# Altium schematic sheet God68_Schematic_Altium.schdoc
size 476 x 264 mm
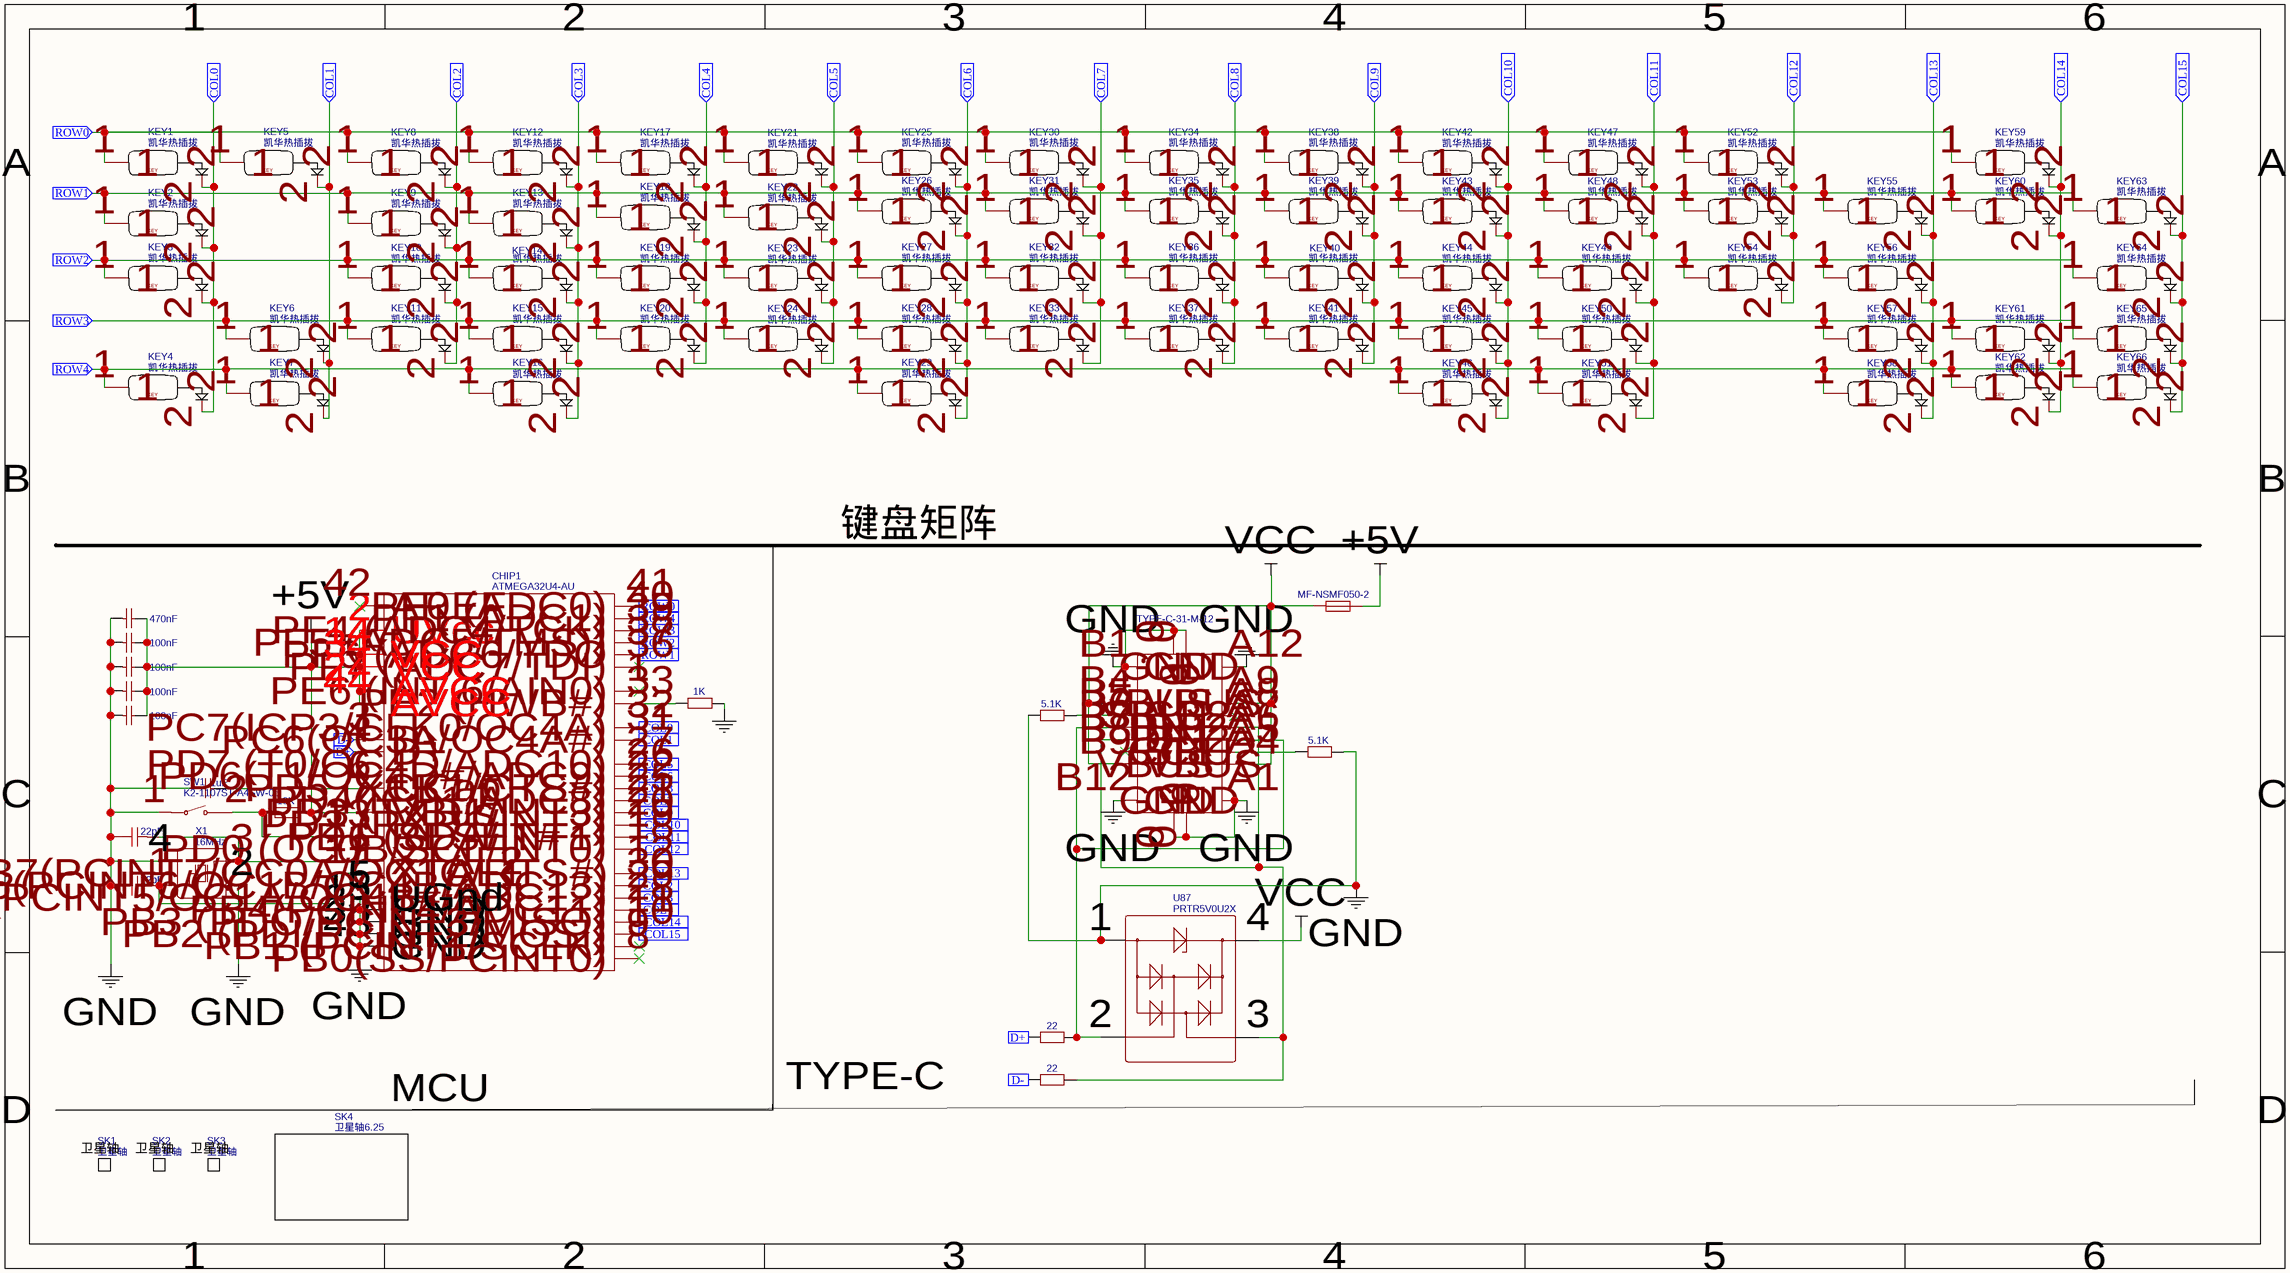
[diagram p0: God68_Schematic_Altium.schdoc]

## Parts
C4  100nF  [C0603]
C5  100nF  [C0603]
C6  100nF  [C0603]
C7  470nF  [C0603]
C10  100nF  [C0603]
C11  1uF  [C0603]
C12  22pF  [C0603]
C13  22pF  [C0603]
CHIP1  ATMEGA32U4-AU  [QFP-44_L10.0-W10.0-P0.80-LS13.2-BL]
KEY1  凯华热插拔  [凯华热插拔]
KEY2  凯华热插拔  [凯华热插拔]
KEY3  凯华热插拔  [凯华热插拔]
KEY4  凯华热插拔  [凯华热插拔]
KEY5  凯华热插拔  [凯华热插拔]
KEY6  凯华热插拔  [凯华热插拔]
KEY7  凯华热插拔  [凯华热插拔]
KEY8  凯华热插拔  [凯华热插拔]
KEY9  凯华热插拔  [凯华热插拔]
KEY10  凯华热插拔  [凯华热插拔]
KEY11  凯华热插拔  [凯华热插拔]
KEY12  凯华热插拔  [凯华热插拔]
KEY13  凯华热插拔  [凯华热插拔]
KEY14  凯华热插拔  [凯华热插拔]
KEY15  凯华热插拔  [凯华热插拔 COPY]
KEY16  凯华热插拔  [凯华热插拔]
KEY17  凯华热插拔  [凯华热插拔]
KEY18  凯华热插拔  [凯华热插拔]
KEY19  凯华热插拔  [凯华热插拔]
KEY20  凯华热插拔  [凯华热插拔]
KEY21  凯华热插拔  [凯华热插拔]
KEY22  凯华热插拔  [凯华热插拔]
KEY23  凯华热插拔  [凯华热插拔]
KEY24  凯华热插拔  [凯华热插拔]
KEY25  凯华热插拔  [凯华热插拔]
KEY26  凯华热插拔  [凯华热插拔]
KEY27  凯华热插拔  [凯华热插拔]
KEY28  凯华热插拔  [凯华热插拔]
KEY29  凯华热插拔  [凯华热插拔]
KEY30  凯华热插拔  [凯华热插拔]
KEY31  凯华热插拔  [凯华热插拔]
KEY32  凯华热插拔  [凯华热插拔]
KEY33  凯华热插拔  [凯华热插拔]
KEY34  凯华热插拔  [凯华热插拔]
KEY35  凯华热插拔  [凯华热插拔]
KEY36  凯华热插拔  [凯华热插拔]
KEY37  凯华热插拔  [凯华热插拔]
KEY38  凯华热插拔  [凯华热插拔]
KEY39  凯华热插拔  [凯华热插拔]
KEY40  凯华热插拔  [凯华热插拔]
KEY41  凯华热插拔  [凯华热插拔]
KEY42  凯华热插拔  [凯华热插拔]
KEY43  凯华热插拔  [凯华热插拔]
KEY44  凯华热插拔  [凯华热插拔]
KEY45  凯华热插拔  [凯华热插拔]
KEY46  凯华热插拔  [凯华热插拔]
KEY47  凯华热插拔  [凯华热插拔]
KEY48  凯华热插拔  [凯华热插拔]
KEY49  凯华热插拔  [凯华热插拔]
KEY50  凯华热插拔  [凯华热插拔]
KEY51  凯华热插拔  [凯华热插拔]
KEY52  凯华热插拔  [凯华热插拔]
KEY53  凯华热插拔  [凯华热插拔]
KEY54  凯华热插拔  [凯华热插拔]
KEY55  凯华热插拔  [凯华热插拔]
KEY56  凯华热插拔  [凯华热插拔]
KEY57  凯华热插拔  [凯华热插拔]
KEY58  凯华热插拔  [凯华热插拔]
KEY59  凯华热插拔  [凯华热插拔]
KEY60  凯华热插拔  [凯华热插拔]
KEY61  凯华热插拔  [凯华热插拔]
KEY62  凯华热插拔  [凯华热插拔]
KEY63  凯华热插拔  [凯华热插拔]
KEY64  凯华热插拔  [凯华热插拔]
KEY65  凯华热插拔  [凯华热插拔]
KEY66  凯华热插拔  [凯华热插拔]
R1  1K  [R0805]
R2  10K  [R0805]
R96  22  [R0805]
R97  22  [R0805]
R98  5.1K  [R0805]
R99  5.1K  [R0805]
SK1  卫星轴  [凯华热插拔 2U]
SK2  卫星轴  [凯华热插拔 2U]
SK3  卫星轴  [凯华热插拔 2U]
SK4  卫星轴6.25  [6.25U]
SW1  K2-1107ST-A4SW-06  [KEY-SMD_L6.2-W3.6-LS8.0]
U87  PRTR5V0U2X  [SOT-143_L2.9-W1.3-P1.92-LS2.3-BL]
U88  MF-NSMF050-2  [F1206]
USBC2  TYPE-C-31-M-12  [USB-C_SMD-TYPE-C-31-M-12]
X1  16MHz  [OSC-SMD_4P-L3.2-W2.5-BL]

## Ports
COL0 (in), COL1 (in), COL2 (in), COL3 (in), COL4 (in), COL5 (in), COL6 (in), COL7 (in), COL8 (in), COL9 (in), COL10 (in), COL11 (in), COL12 (in), COL13 (in), COL14 (in), COL15 (in), D+ (in), D- (in), ROW0 (in), ROW1 (in), ROW2 (in), ROW3 (in), ROW4 (in)

## Nets
+5V: C4.2 C5.2 C6.2 C7.2 C10.2 CHIP1.2(UVcc) CHIP1.7(VBus) CHIP1.14(VCC) CHIP1.24(AVCC) CHIP1.34(VCC) CHIP1.44(AVCC) R2.2 U88.2
GND: C4.1 C5.1 C6.1 C7.1 C10.1 C11.1 C12.1 C13.1 CHIP1.5(UGnd) CHIP1.15(GND) CHIP1.23(GND) CHIP1.35(GND) CHIP1.43(GND) R1.2 R98.1 R99.2 SW1.1 U87.1(GND) USBC2.0 USBC2.A1(GND) USBC2.A12(GND) USBC2.B1(GND) USBC2.B12(GND) X1.2(GND) X1.4(GND)
VCC: U87.4(VCC) U88.1 USBC2.A4(VBUS) USBC2.A9(VBUS) USBC2.B4(VBUS) USBC2.B9(VBUS)
COL0: CHIP1.32(PC7(ICP3/CLK0/OC4A)) KEY1.2 KEY2.2 KEY3.2 KEY4.2 ; port COL0
COL1: CHIP1.31(PC6(OC3A/OC4A#)) KEY5.2 KEY6.2 KEY7.2 ; port COL1
COL2: CHIP1.30(PB6(PCINT6/OC1B/OC4B/ADC13)) KEY8.2 KEY9.2 KEY10.2 KEY11.2 ; port COL2
COL3: CHIP1.29(PB5(PCINT5/OC1A/OC4B#/ADC12)) KEY12.2 KEY13.2 KEY14.2 KEY15.2 KEY16.2 ; port COL3
COL4: CHIP1.28(PB4(PCINT4/ADC11)) KEY17.2 KEY18.2 KEY19.2 KEY20.2 ; port COL4
COL5: CHIP1.27(PD7_(T0/OC4D/ADC10)) KEY21.2 KEY22.2 KEY23.2 KEY24.2 ; port COL5
COL6: CHIP1.26(PD6(T1/OC4D#/ADC9)) KEY25.2 KEY26.2 KEY27.2 KEY28.2 KEY29.2 ; port COL6
COL7: CHIP1.25(PD4(ICP1/ADC8)) KEY30.2 KEY31.2 KEY32.2 KEY33.2 ; port COL7
COL8: CHIP1.22(PD5_(XCK1/CTS#)) KEY34.2 KEY35.2 KEY36.2 KEY37.2 ; port COL8
COL9: CHIP1.21(PD3_(TXD1/INT3)) KEY38.2 KEY39.2 KEY40.2 KEY41.2 ; port COL9
COL10: CHIP1.20(PD2_(RXD1/INT2)) KEY42.2 KEY43.2 KEY44.2 KEY45.2 KEY46.2 ; port COL10
COL11: CHIP1.19(PD1_(SDA/INT1)) KEY47.2 KEY48.2 KEY49.2 KEY50.2 KEY51.2 ; port COL11
COL12: CHIP1.18(PD0_(OC0B/SCL/INT0)) KEY52.2 KEY53.2 KEY54.2 ; port COL12
COL13: CHIP1.12(PB7(PCINT7/OC0A/OC1C/RTS#)) KEY55.2 KEY56.2 KEY57.2 KEY58.2 ; port COL13
COL14: CHIP1.11(PB3_(PDO/PCINT3/MISO)) KEY59.2 KEY60.2 KEY61.2 KEY62.2 ; port COL14
COL15: CHIP1.10(PB2_(PDI/PCINT2/MOSI)) KEY63.2 KEY64.2 KEY65.2 KEY66.2 ; port COL15
D+: CHIP1.4(D+) R97.1 ; port D+
D-: CHIP1.3(D-) R96.1 ; port D-
ROW0: CHIP1.41(PF0_(ADC0)) KEY1.1 KEY5.1 KEY8.1 KEY12.1 KEY17.1 KEY21.1 KEY25.1 KEY30.1 KEY34.1 KEY38.1 KEY42.1 KEY47.1 KEY52.1 KEY59.1 ; port ROW0
ROW1: CHIP1.37(PF6_(ADC6/TDO) KEY2.1 KEY9.1 KEY13.1 KEY18.1 KEY22.1 KEY26.1 KEY31.1 KEY35.1 KEY39.1 KEY43.1 KEY48.1 KEY53.1 KEY55.1 KEY60.1 KEY63.1 ; port ROW1
ROW2: CHIP1.38(PF5_(ADC5/TMS))) KEY3.1 KEY10.1 KEY14.1 KEY19.1 KEY23.1 KEY27.1 KEY32.1 KEY36.1 KEY40.1 KEY44.1 KEY49.1 KEY54.1 KEY56.1 KEY64.1 ; port ROW2
ROW3: CHIP1.39(PF4_(ADC4/TCK)) KEY6.1 KEY11.1 KEY15.1 KEY20.1 KEY24.1 KEY28.1 KEY33.1 KEY37.1 KEY41.1 KEY45.1 KEY50.1 KEY57.1 KEY61.1 KEY65.1 ; port ROW3
ROW4: CHIP1.40(PF1_(ADC1)) KEY4.1 KEY7.1 KEY16.1 KEY29.1 KEY46.1 KEY51.1 KEY58.1 KEY62.1 KEY66.1 ; port ROW4
NetC11_2: C11.2 CHIP1.6(UCap)
NetC12_2: C12.2 CHIP1.16(XTAL2) X1.3(OSC2)
NetC13_2: C13.2 CHIP1.17(XTAL1) X1.1(OSC1)
NetCHIP1_13: CHIP1.13(RESET#) R2.1 SW1.2
NetCHIP1_33: CHIP1.33(PE2_(HWB#)) R1.1
NetR96_2: R96.2 U87.3(IO2) USBC2.A7(DN1) USBC2.B7(DN2)
NetR97_2: R97.2 U87.2(IO1) USBC2.A6(DP1) USBC2.B6(DP2)
NetR98_2: R98.2 USBC2.B5(CC2)
NetR99_1: R99.1 USBC2.A5(CC1)

Not connected (* = marked no-connect by the designer): CHIP1 1(PE6_(INT.6/AIN0))* 8(PB0(SS/PCINT0))* 9(PB1_(PCINT1/SCLK))* 36(PF7_(ADC7/TDI))* 42(AREF)*; USBC2 A8(SBU1)* B8(SBU2)*

## Notes on the sheet
- 键盘矩阵
- (near C13) 22pF
- MCU
- TYPE-C
- (in symbol 凯华热插拔) KEY

## Library data of the parts
C4-C6 C10 = 100nF: BOM_Manufacturer Part: CL10B104JB8NNNC; BOM_Manufacturer: SAMSUNG; nameAlias: Capacitance; SMT Type: Extend; BOM_Supplier: LCSC; BOM_Supplier Part: C24452; BOM_LCSC Assembly: Yes; spicePre: C; spiceSymbolName: CL10B104JB8NNNC
C7 = 470nF: BOM_Manufacturer Part: CL10B474KA8NNNC; BOM_Manufacturer: SAMSUNG; nameAlias: Capacitance; SMT Type: Basic; BOM_Supplier: LCSC; BOM_LCSC Assembly: Yes; BOM_Supplier Part: C1623; spicePre: C; spiceSymbolName: CL10B474KA8NNNC
C11 = 1uF: BOM_Manufacturer Part: CL10A105KB8NNNC; BOM_Manufacturer: SAMSUNG; nameAlias: Capacitance; SMT Type: Basic; BOM_Supplier: LCSC; BOM_LCSC Assembly: Yes; BOM_Supplier Part: C15849; spicePre: C; spiceSymbolName: CL10A105KB8NNNC
C12 C13 = 22pF: BOM_Manufacturer: SAMSUNG; BOM_Manufacturer Part: CL10C220JB81PNC; nameAlias: Capacitance; Contributor: LCSC; SMT Type: Extend; BOM_Supplier: LCSC; BOM_Supplier Part: C170132; BOM_LCSC Assembly: Yes; spicePre: C; spiceSymbolName: CL10C220JB81PNC
CHIP1 = ATMEGA32U4-AU: BOM_Manufacturer: MICROCHIP; SMT Type: Extend; BOM_Supplier: LCSC; BOM_Manufacturer Part: ATMEGA32U4-AU; image: //image.lceda.cn/szlcsc/C44854.jpg; BOM_Supplier Part: C44854; BOM_LCSC Assembly: Yes; spicePre: U; spiceSymbolName: ATMEGA32U4-AU
KEY1-KEY66 = 凯华热插拔: BOM_Manufacturer: Tak Cheong; BOM_Manufacturer Part: 1N4148W; Contributor: bubuy; BOM_Supplier Part: C129216; BOM_Supplier: LCSC; spiceSymbolName: 凯华热插拔
  KEY1: spicePre: K
  KEY2-KEY66: spicePre: U
R1 = 1K: BOM_Manufacturer: Viking Tech; BOM_Manufacturer Part: AR05FTC1001; nameAlias: Resistance (Ohms); SMT Type: Extend; BOM_Supplier: LCSC; BOM_Supplier Part: C234806; BOM_LCSC Assembly: Yes; spicePre: R; spiceSymbolName: TC0525F1001T5E
R2 = 10K: BOM_Manufacturer: UniOhm; BOM_Manufacturer Part: 0805W8F1002T5E; nameAlias: Resistance (Ohms); SMT Type: Basic; BOM_Supplier: LCSC; BOM_LCSC Assembly: Yes; BOM_Supplier Part: C17414; spicePre: R; spiceSymbolName: 0805W8F1002T5E
R96 R97 = 22: BOM_Manufacturer: UniOhm; BOM_Manufacturer Part: 0603WAF220JT5E; nameAlias: Resistance (Ohms); SMT Type: Basic; BOM_Supplier: LCSC; BOM_LCSC Assembly: Yes; BOM_Supplier Part: C23345; spicePre: R; spiceSymbolName: 0603WAF220JT5E
R98 R99 = 5.1K: BOM_Manufacturer: FH; BOM_Manufacturer Part: RS-05K5101FT; nameAlias: Resistance (Ohms); SMT Type: Basic; BOM_Supplier: LCSC; BOM_LCSC Assembly: Yes; BOM_Supplier Part: C118848; spicePre: R; spiceSymbolName: 0805W8F5101T5E
SK1-SK3 = 卫星轴: Contributor: lleaves; BOM_pre: C2099; BOM_Supplier Part: C2099; spicePre: U; spiceSymbolName: 卫星轴
SK4 = 卫星轴6.25: Contributor: hearme; spicePre: U; spiceSymbolName: 卫星轴6.25
SW1 = K2-1107ST-A4SW-06: BOM_Manufacturer: Rectangular Connectors - Contacts; Contributor: LCSC; BOM_Supplier: LCSC; BOM_Supplier Part: C118141; BOM_Manufacturer Part: K2-1107ST-A4SW-06; spicePre: S; spiceSymbolName: K2-1107ST-A4SW-06
U87 = PRTR5V0U2X: BOM_Manufacturer: Nexperia; BOM_Manufacturer Part: PRTR5V0U2X,215; Contributor: LCSC; BOM_Supplier: LCSC; BOM_Supplier Part: C12333; spicePre: D; spiceSymbolName: PRTR5V0U2X
U88 = MF-NSMF050-2: BOM_Manufacturer: BHFUSE; BOM_Manufacturer Part: BSMD1206-050-13.2V; SMT Type: Extend; BOM_Supplier: LCSC; BOM_Supplier Part: C883123; BOM_LCSC Assembly: Yes; spicePre: U; spiceSymbolName: MF-NSMF050-2
USBC2 = TYPE-C-31-M-12: BOM_Manufacturer: Rectangular Connectors - Contacts; Contributor: LCSC; BOM_Supplier: LCSC; BOM_Supplier Part: C165948; BOM_Manufacturer Part: TYPE-C-31-M-12; spicePre: U; spiceSymbolName: TYPE-C-31-M-12
X1 = 16MHz: BOM_Manufacturer: YXC; BOM_Manufacturer Part: X322516MRB4SI; nameAlias: Frequency; SMT Type: Extend; BOM_Supplier: LCSC; BOM_Supplier Part: C70562; BOM_JLCPCB SMD: Yes; spicePre: X; spiceSymbolName: X322516MRB4SI